# EasyEDA Pro project v02_N.eprj

# Schematic Schematic1
Board Name: Board1; Create Date: 2023-01-16; Project Name: v02_k; Schematic Name: Schematic1; Update Date: 2024-09-27; Company: KC3LBR; Version: 2023.09.11
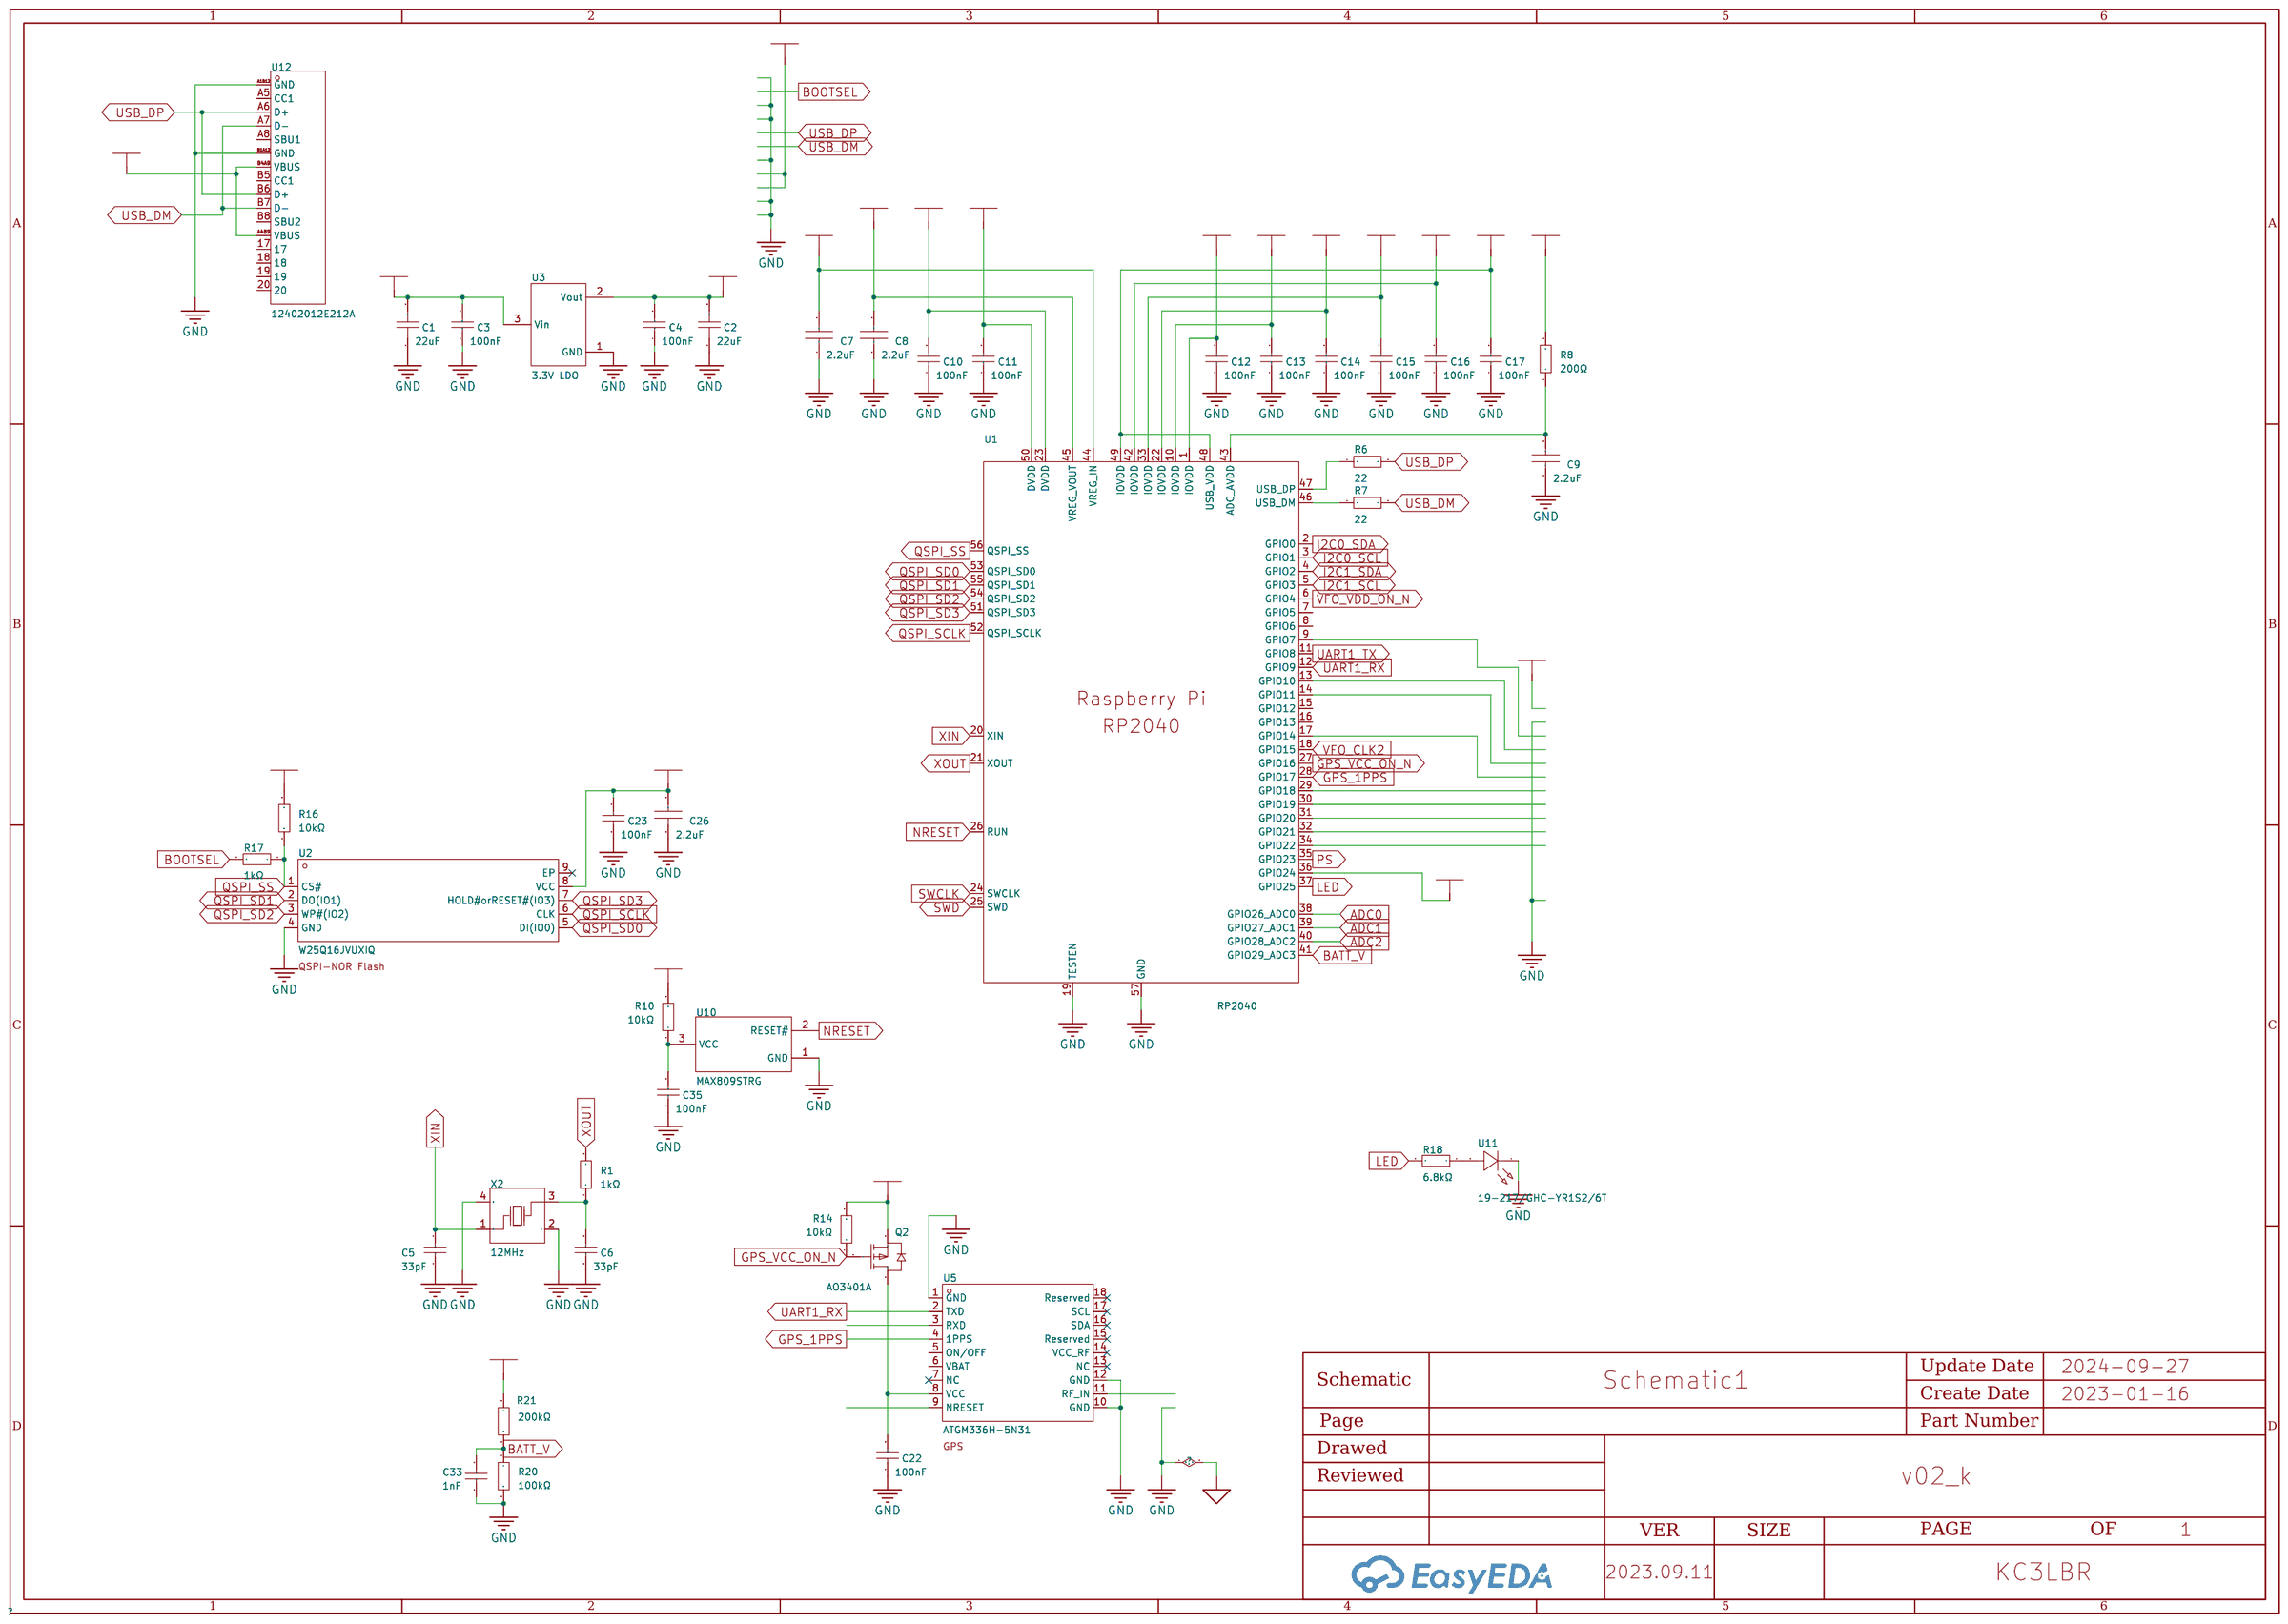
[diagram p0: schematic sheet]

## Parts
C1  22uF  [C0805]
C2  22uF  [C0603]
C3  100nF  [C0402_NEW]
C4  100nF  [C0402_NEW]
C5  33pF  [C0402]
C6  33pF  [C0402]
C7  2.2uF  [C0402]
C8  2.2uF  [C0402]
C9  2.2uF  [C0402]
C10  100nF  [C0402_NEW]
C11  100nF  [C0402_NEW]
C12  100nF  [C0402_NEW]
C13  100nF  [C0402_NEW]
C14  100nF  [C0402_NEW]
C15  100nF  [C0402_NEW]
C16  100nF  [C0402_NEW]
C17  100nF  [C0402_NEW]
C22  100nF  [C0402_NEW]
C23  100nF  [C0402_NEW]
C26  2.2uF  [C0402]
C33  1nF  [C0402]
C35  100nF  [C0402_NEW]
Q2  AO3401A  [SOT-23_L2.9-W1.3-P1.90-LS2.4-BR]
R1  1kΩ  [R0402]
R6  22  [R0402]
R7  22  [R0402]
R8  200Ω  [R0402]
R10  10kΩ  [R0402]
R14  10kΩ  [R0402]
R16  10kΩ  [R0402]
R17  1kΩ  [R0402]
R18  6.8kΩ  [R0402]
R20  100kΩ  [R0402]
R21  200kΩ  [R0402]
U1  RP2040  [LQFN-56_L7.0-W7.0-P0.4-EP]
U2  W25Q16JVUXIQ  [USON-8_L3.0-W2.0-P0.50-BL-EP]
U3  3.3V LDO  [SOT-23-3_L2.9-W1.6-P1.90-LS2.8-BR]
U5  ATGM336H-5N31  [GPSM-SMD_ATGM336H-TR]
U10  MAX809STRG  [SOT-23-3_L2.9-W1.6-P1.90-LS2.8-BR]
U11  19-217/GHC-YR1S2/6T  [LED0603-RD_GREEN]
U12  12402012E212A  [USB-SMD_TYPE-C16PIN-1]
X2  12MHz  [OSC-SMD_4P-L3.2-W2.5-BL]

## Library data of the parts
C1 = CL21A226MAQNNNE_C45783: Capacitance: Tolerance:±20% Tolerance:±20% Voltage Rated: Temperature Coefficient:; LCSC Part Name: 22uF ±20% 25V; Supplier Part: C45783; Manufacturer: SAMSUNG(三星); Manufacturer Part: CL21A226MAQNNNE; Supplier Footprint: 0805; JLCPCB Part Class: Basic Part; Datasheet: https://atta.szlcsc.com/upload/public/pdf/source/20160103/1457707727161.pdf; Supplier: LCSC; Tolerance: ±20%
C2 = CL10A226MQ8NRNC: Capacitance: Tolerance:±20% Tolerance:±20% Voltage Rated: Temperature Coefficient:; LCSC Part Name: 22uF ±20% 6.3V; Supplier Part: C59461; Manufacturer: SAMSUNG(三星); Supplier Footprint: 0603; JLCPCB Part Class: Basic Part; Datasheet: https://atta.szlcsc.com/upload/public/pdf/source/20160103/1457707740762.pdf; Supplier: LCSC; Tolerance: ±20%
C3 C4 C10-C17 C22 C23 C35 = CL05B104KO5NNNC: Capacitance: Tolerance:±10% Tolerance:±10% Voltage Rated: Temperature Coefficient:; LCSC Part Name: 100nF ±10% 16V; Supplier Part: C1525; Manufacturer: SAMSUNG(三星); Supplier Footprint: 0402; JLCPCB Part Class: Basic Part; Datasheet: https://atta.szlcsc.com/upload/public/pdf/source/20160103/1457707674891.pdf; Supplier: LCSC; Tolerance: ±10%
C5 C6 = 0402CG330J500NT: Capacitance: Tolerance:±5% Tolerance:±5% Voltage Rated: Temperature Coefficient:; LCSC Part Name: 33pF ±5% 50V; Supplier Part: C1562; Manufacturer: FH(风华); Supplier Footprint: 0402; JLCPCB Part Class: Basic Part; Datasheet: https://atta.szlcsc.com/upload/public/pdf/source/20170923/C1562_1506149272462988369.pdf; Supplier: LCSC; Tolerance: ±5%
C7-C9 C26 = CL05A225MQ5NSNC: Capacitance: Tolerance:±20% Tolerance:±20% Voltage Rated: Temperature Coefficient:; LCSC Part Name: 2.2uF ±20% 6.3V; Supplier Part: C12530; Manufacturer: SAMSUNG(三星); Supplier Footprint: 0402; JLCPCB Part Class: Basic Part; Datasheet: https://atta.szlcsc.com/upload/public/pdf/source/20160103/1457707666860.pdf; Supplier: LCSC; Tolerance: ±20%
C33 = 0402B102K500NT: Capacitance: Tolerance:±10% Tolerance:±10% Voltage Rated: Temperature Coefficient:; LCSC Part Name: 1nF ±10% 50V; Supplier Part: C1523; Manufacturer: FH(风华); Supplier Footprint: 0402; JLCPCB Part Class: Basic Part; Datasheet: https://atta.szlcsc.com/upload/public/pdf/source/20170923/C1523_1506149254821988331.pdf; Supplier: LCSC; Tolerance: ±10%
Q2 = AO3401A_C15127: Type: Drain Source Voltage (Vdss): Continuous Drain Current (Id): Power Dissipation (Pd): Drain Source On Resistance (RDS(on)@Vgs,Id):44mΩ@10V,4.3A Gate Threshold Voltage (Vgs(th)@Id):1.3V@250uA; LCSC Part Name: P沟道 30V 4A; Supplier Part: C15127; Manufacturer: AOS; Supplier Footprint: SOT-23; JLCPCB Part Class: Basic Part; Datasheet: https://atta.szlcsc.com/upload/public/pdf/source/20160507/1462613609053.pdf; Supplier: LCSC; Drain Source On Resistance (RDS(on)@Vgs,Id): 44mΩ@10V,4.3A; Gate Threshold Voltage (Vgs(th)@Id): 1.3V@250uA
R1 R17 = 0402WGF1001TCE: Type:Thick Film Resistors Resistance: Tolerance:±1% Tolerance:±1% Power(Watts): Temperature Coefficient:±100ppm/ Temperature Coefficient:±100ppm/ Overload Voltage (Max): Operating Temperature Range:-55~+155 Operating Temperature Range:-55~+155; LCSC Part Name: 1kΩ ±1% 62.5mW; Supplier Part: C11702; Manufacturer: UNI-ROYAL(厚声); Supplier Footprint: 0402; JLCPCB Part Class: Basic Part; Datasheet: https://atta.szlcsc.com/upload/public/pdf/source/20200306/C422600_1E6D84923E4A46A82E41ADD87F860B5C.pdf; Supplier: LCSC; Type: Thick Film Resistors; Tolerance: ±1%; Temperature Coefficient: ±100ppm/; Operating Temperature Range: -55~+155
R6 R7 = 0402WGF220JTCE: LCSC Part Name: 22Ω(22R0) ±1% 编带; Supplier Part: C25092; Manufacturer: UNI-ROYAL(厚声); Supplier Footprint: 0402; JLCPCB Part Class: Basic Part; Datasheet: https://atta.szlcsc.com/upload/public/pdf/source/20170920/C25092_1505901206069982723.pdf; Supplier: LCSC
R8 = 0402WGF2000TCE: Type:Thick Film Resistors Resistance: Tolerance:±1% Tolerance:±1% Power(Watts): Temperature Coefficient:±100ppm/ Temperature Coefficient:±100ppm/ Overload Voltage (Max): Operating Temperature Range:-55~+155 Operating Temperature Range:-55~+155; LCSC Part Name: 200Ω ±1% 62.5mW; Supplier Part: C25087; Manufacturer: UNI-ROYAL(厚声); Supplier Footprint: 0402; JLCPCB Part Class: Basic Part; Datasheet: https://atta.szlcsc.com/upload/public/pdf/source/20200306/C422600_1E6D84923E4A46A82E41ADD87F860B5C.pdf; Supplier: LCSC; Type: Thick Film Resistors; Tolerance: ±1%; Temperature Coefficient: ±100ppm/; Operating Temperature Range: -55~+155
R10 R14 R16 = 0402WGF1002TCE: Type:Thick Film Resistors Resistance: Tolerance:±1% Tolerance:±1% Power(Watts): Temperature Coefficient:±100ppm/ Temperature Coefficient:±100ppm/ Overload Voltage (Max): Operating Temperature Range:-55~+155 Operating Temperature Range:-55~+155; LCSC Part Name: 10kΩ ±1% 62.5mW; Supplier Part: C25744; Manufacturer: UNI-ROYAL(厚声); Supplier Footprint: 0402; JLCPCB Part Class: Basic Part; Datasheet: https://atta.szlcsc.com/upload/public/pdf/source/20200306/C422600_1E6D84923E4A46A82E41ADD87F860B5C.pdf; Supplier: LCSC; Type: Thick Film Resistors; Tolerance: ±1%; Temperature Coefficient: ±100ppm/; Operating Temperature Range: -55~+155
R18 = 0402WGF6801TCE: Type:Thick Film Resistors Resistance: Tolerance:±1% Tolerance:±1% Power(Watts): Temperature Coefficient:±100ppm/ Temperature Coefficient:±100ppm/ Overload Voltage (Max): Operating Temperature Range:-55~+155 Operating Temperature Range:-55~+155; LCSC Part Name: 6.8kΩ ±1% 62.5mW; Supplier Part: C25917; Manufacturer: UNI-ROYAL(厚声); Supplier Footprint: 0402; JLCPCB Part Class: Basic Part; Datasheet: https://atta.szlcsc.com/upload/public/pdf/source/20200306/C422600_1E6D84923E4A46A82E41ADD87F860B5C.pdf; Supplier: LCSC; Type: Thick Film Resistors; Tolerance: ±1%; Temperature Coefficient: ±100ppm/; Operating Temperature Range: -55~+155
R20 = 0402WGF1003TCE: Type:Thick Film Resistors Resistance: Tolerance:±1% Tolerance:±1% Power(Watts): Temperature Coefficient:±100ppm/ Temperature Coefficient:±100ppm/ Overload Voltage (Max): Operating Temperature Range:-55~+155 Operating Temperature Range:-55~+155; LCSC Part Name: 100kΩ ±1% 62.5mW; Supplier Part: C25741; Manufacturer: UNI-ROYAL(厚声); Supplier Footprint: 0402; JLCPCB Part Class: Basic Part; Datasheet: https://atta.szlcsc.com/upload/public/pdf/source/20200306/C422600_1E6D84923E4A46A82E41ADD87F860B5C.pdf; Supplier: LCSC; Type: Thick Film Resistors; Tolerance: ±1%; Temperature Coefficient: ±100ppm/; Operating Temperature Range: -55~+155
R21 = 0402WGF2003TCE: Resistance: Tolerance: Power(Watts): Temperature Coefficient: Temperature Coefficient: Overload Voltage (Max): Operating Temperature Range: Operating Temperature Range:; LCSC Part Name: 200KΩ ±1%; Supplier Part: C25764; Manufacturer: UNI-ROYAL(厚声); Supplier Footprint: 0402; JLCPCB Part Class: Basic Part; Datasheet: https://atta.szlcsc.com/upload/public/pdf/source/20170920/C25764_1505901532268983339.pdf; Supplier: LCSC
U1 = RP2040_C2040: CPU Core:ARM Cortex-M0 Maximum Frequency:133MHz Supply Voltage Range:- Supply Voltage Range:- Internal Oscillator:- External Clock Frequency Rang:- External Clock Frequency Rang:- Program FLASH Size:- RAM Size:264KB EEPROM/Data FLASH Size:- GPIO Ports Num; LCSC Part Name: ARM Cortex-M0 133MHz RAM：264KB; Supplier Part: C2040; Manufacturer: Raspberry Pi(树莓派); Supplier Footprint: LQFN-56(7x7); JLCPCB Part Class: Extended Part; Datasheet: https://atta.szlcsc.com/upload/public/pdf/source/20210621/C2040_96F425825606B7957D87DD32E2512CA9.pdf; Supplier: LCSC; CPU Core: ARM Cortex-M0; Maximum Frequency: 133MHz; RAM Size: 264KB; GPIO Ports Number: 30; ADC (Units/Channels/bits): 1@x4ch/12bit; U(S)ART Number: 2; I2C Number: 2; (Q)SPI Number: 2; USB (H/D/OTG): USB Host/Device; Peripherals / Functions / Protocol Stacks: DMA；PWM
U2 = W25Q16JVUXIQ: QSPI-NOR Flash; Supplier Part: C2843335; Manufacturer: WINBOND(华邦); Supplier Footprint: USON-8; JLCPCB Part Class: Extended Part; Datasheet: https://atta.szlcsc.com/upload/public/pdf/source/20210629/C2843335_FB4D78B5076715625DC0C83F790D3044.pdf; Supplier: LCSC
U3 = XC6206P332MR_C5446: Output Type: Output Polarity:Positive Number of Outputs:1 Maximum Input Voltage:6V Output Voltage:3.3V~3.3V Output Voltage:3.3V~3.3V Dropout Voltage:680mV@(100mA) Output Current:200mA Power Supply Rejection Ratio (PSRR):-; LCSC Part Name: 正 Vin=6V Vout=3.3V 200mA; Supplier Part: C5446; Manufacturer: TOREX(特瑞仕); Manufacturer Part: XC6206P332MR; Supplier Footprint: SOT-23; JLCPCB Part Class: Basic Part; Datasheet: https://atta.szlcsc.com/upload/public/pdf/source/20130801/1457706628791.pdf; Supplier: LCSC; Output Polarity: Positive; Number of Outputs: 1; Maximum Input Voltage: 6V; Output Voltage: 3.3V~3.3V; Dropout Voltage: 680mV@(100mA); Output Current: 200mA
U5 = ATGM336H-5N31: GPS; Supplier Part: C90770; Manufacturer: 杭州中科微; Supplier Footprint: 9.7x10.1mm; JLCPCB Part Class: Extended Part; Datasheet: https://atta.szlcsc.com/upload/public/pdf/source/20161226/1482720799860.pdf; Supplier: LCSC
U10 = MAX809STRG: Output Type:推挽 Reset Active Level:低电平有效 Number of Voltages Monitored:1 Threshold Voltage:2.93V Reset Timeout:140ms Operating Temperature:-40~+105@(TJ) Operating Temperature:-40~+105@(TJ) Type of the Power Management Chip:Simple reset/Power-on reset; LCSC Part Name: Voltage Supervisor, Very Low Supply Current, 3-Pin Microprocessor, Reset Monitor; Supplier Part: C9965; Manufacturer: onsemi(安森美); Supplier Footprint: SOT-23; JLCPCB Part Class: Extended Part; Datasheet: https://atta.szlcsc.com/upload/public/pdf/source/20170918/C9965_1505727085373976535.PDF; Supplier: LCSC; Output Type: 推挽; Reset Active Level: 低电平有效; Number of Voltages Monitored: 1; Threshold Voltage: 2.93V; Reset Timeout: 140ms; Operating Temperature: -40~+105@(TJ); Type of the Power Management Chip: Simple reset/Power-on reset
U11 = 19-217/GHC-YR1S2/6T: LCSC Part Name: 翠绿; Supplier Part: C2986059; Manufacturer: EVERLIGHT(亿光); Supplier Footprint: 0603; JLCPCB Part Class: Extended Part; Datasheet: https://atta.szlcsc.com/upload/public/pdf/source/20220705/5270194960AA522E2931401D212035CB.pdf; Supplier: LCSC
U12 = 12402012E212A: LCSC Part Name: Type-C 母; Supplier Part: C5150972; Manufacturer: Amphenol; Supplier Footprint: SMD; JLCPCB Part Class: Extended Part; Datasheet: https://atta.szlcsc.com/upload/public/pdf/source/20230904/1AC50813D61D39FDC7D46AE00E914630.pdf; Supplier: LCSC; Connector Type: Type-C; Standard: USB 2.0; Gender: Female; Number of Contacts: 24P; Number of Ports: 1
X2 = X322512MSB4SI: Crystal Type:SMD Crystal Resonator Frequency: Frequency Tolerance:±10ppm Frequency Tolerance:±10ppm Frequency Stability:±30ppm Frequency Stability:±30ppm Load Capacitance: Operating Temperature: Operating Temperature:; LCSC Part Name: 12MHz ±10ppm 20pF; Supplier Part: C9002; Manufacturer: YXC(扬兴晶振); Supplier Footprint: SMD3225-4P; JLCPCB Part Class: Basic Part; Datasheet: https://atta.szlcsc.com/upload/public/pdf/source/20210329/C112971_1F611BDC486E193C1706F6D8EB5AA189.pdf; Supplier: LCSC; Crystal Type: SMD Crystal Resonator; Frequency Tolerance: ±10ppm; Frequency Stability: ±30ppm

## Nets
1V1: C8.2 C10.2 C11.2 U1.23(DVDD) U1.45(VREG_VOUT) U1.50(DVDD)
3V3: C2.2 C4.2 C7.2 C12.2 C13.2 C14.2 C15.2 C16.2 C17.2 C23.2 C26.2 Q2.2(S) R8.2 R10.2 R14.2 R16.2 U1.1(IOVDD) U1.10(IOVDD) U1.22(IOVDD) U1.33(IOVDD) U1.36(GPIO24) U1.42(IOVDD) U1.44(VREG_IN) U1.48(USB_VDD) U1.49(IOVDD) U2.8(VCC) U3.2(Vout)
GND: C1.1 C2.1 C3.1 C4.1 C5.1 C6.1 C7.1 C8.1 C9.1 C10.1 C11.1 C12.1 C13.1 C14.1 C15.1 C16.1 C17.1 C22.1 C23.1 C26.1 C33.1 C35.1 R20.2 U1.19(TESTEN) U1.57(GND) U2.4(GND) U3.1(GND) U5.1(GND) U5.10(GND) U5.12(GND) U10.1(GND) U11.1(K) U12.A1B12(GND) U12.B1A12(GND) X2.2(GND) X2.4(GND)
VBUS: C1.2 C3.2 R21.2 U3.3(Vin) U12.A4B9(VBUS) U12.B4A9(VBUS)
ADC0: U1.38(GPIO26_ADC0)
ADC1: U1.39(GPIO27_ADC1)
ADC2: U1.40(GPIO28_ADC2)
ADC_AVDD: C9.2 R8.1 U1.43(ADC_AVDD)
BATT_V: C33.2 R20.1 R21.1 U1.41(GPIO29_ADC3)
BOOTSEL: R17.2
GPIO7: U1.9(GPIO7)
GPIO10: U1.13(GPIO10)
GPIO11: U1.14(GPIO11)
GPIO14: U1.17(GPIO14)
GPIO18: U1.29(GPIO18)
GPIO19: U1.30(GPIO19)
GPIO20: U1.31(GPIO20)
GPIO21: U1.32(GPIO21)
GPIO22: U1.34(GPIO22)
GPS_1PPS: U1.28(GPIO17) U5.4(1PPS)
GPS_3V3: C22.2 Q2.3(D) U5.8(VCC)
GPS_ANT: U5.11(RF_IN)
GPS_VCC_ON_N: Q2.1(G) R14.1 U1.27(GPIO16)
I2C0_SCL: U1.3(GPIO1)
I2C0_SDA: U1.2(GPIO0)
I2C1_SCL: U1.5(GPIO3)
I2C1_SDA: U1.4(GPIO2)
LED: R18.2 U1.37(GPIO25)
NRESET: U1.26(RUN) U10.2(RESET#)
PS: U1.35(GPIO23)
QSPI_SCLK: U1.52(QSPI_SCLK) U2.6(CLK)
QSPI_SD0: U1.53(QSPI_SD0) U2.5(DI(IO0))
QSPI_SD1: U1.55(QSPI_SD1) U2.2(DO(IO1))
QSPI_SD2: U1.54(QSPI_SD2) U2.3(WP#(IO2))
QSPI_SD3: U1.51(QSPI_SD3) U2.7(HOLD#orRESET#(IO3))
QSPI_SS: R16.1 R17.1 U1.56(QSPI_SS) U2.1(CS#)
SWCLK: U1.24(SWCLK)
SWD: U1.25(SWD)
UART1_RX: U1.12(GPIO9) U5.2(TXD)
UART1_TX: U1.11(GPIO8)
USB_DM: R7.2 U12.A7(D-) U12.B7(D-)
USB_DP: R6.2 U12.A6(D+) U12.B6(D+)
VFO_CLK2: U1.18(GPIO15)
VFO_VDD_ON_N: U1.6(GPIO4)
XIN: C5.2 U1.20(XIN) X2.1(OSC1)
XOUT: R1.2 U1.21(XOUT)
$1N22362: R6.1 U1.47(USB_DP)
$1N70752: C6.2 R1.1 X2.3(OSC2)
$1N115739: C35.2 R10.1 U10.3(VCC)
$1N146095: R18.1 U11.2(A)
Net-(R7-1): R7.1 U1.46(USB_DM)

Not connected (* = marked no-connect by the designer): U1 7(GPIO5) 8(GPIO6) 15(GPIO12) 16(GPIO13); U2 9(EP)*; U5 3(RXD) 5(ON/OFF) 6(VBAT) 7(NC)* 9(NRESET) 13(NC)* 14(VCC_RF)* 15(Reserved)* 16(SDA)* 17(SCL)* 18(Reserved)*; U12 17 18 19 20 A5(CC1) A8(SBU1) B5(CC1) B8(SBU2)

# Board PCB1
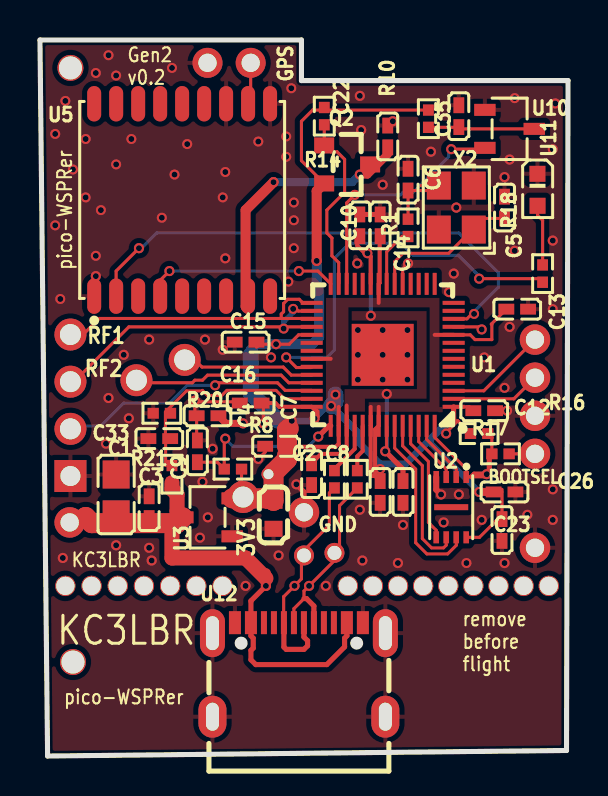
[diagram p1: board, top side]
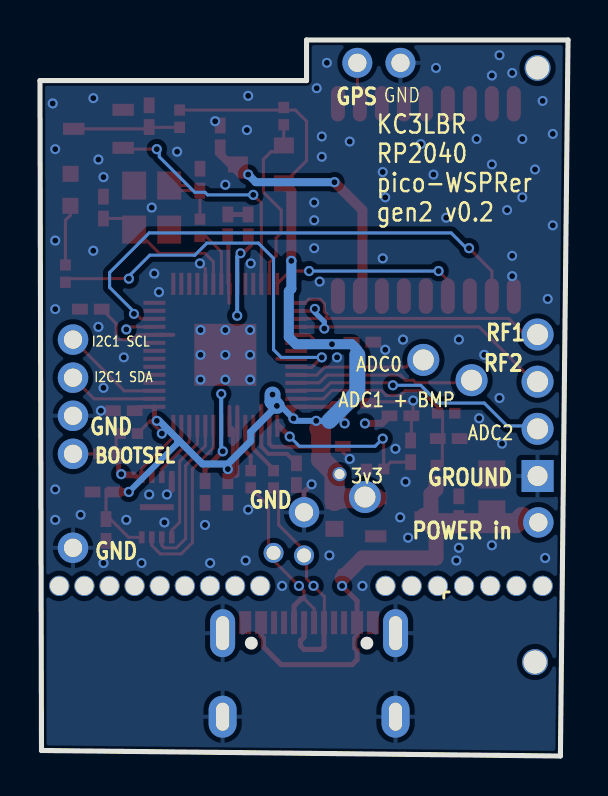
[diagram p2: board, bottom side, seen from below]

Outline 26.42 x 35.81 mm; copper layers: Top Layer, Bottom Layer. Coordinates in mm from the lower left corner of the outline.
Outline path: 0,35.81 0.38,0 26.34,0.28 26.42,33.78 13.08,33.78 13.08,35.81 0,35.81
Stack: Top Layer 0.035mm / Dielectric1 1.51mm FR4 er 4.5 / Bottom Layer 0.035mm

## Design rules (mm)
template: User Custom Config
spacing safeClearance (default): track to track 0.152, other pairs 0.12 to 0.3
track width trackWidth (default): min 0.127, default 0.254, max 2.54
differential pair differentialPair (default): width min 0.127, default 0.254, max 2.54; gap min 0.152, default 0.152
via viaSize (default): diameter min 0.5, default 0.61, max 10; hole min 0.3, default 0.305, max 5.999

## Placement (name value [footprint] x y rotation side)
C1  22uF  [C0805]  3.81 13.08 270 top
C2  22uF  [C0603]  11.68 12.06 90 top
C3  100nF  [C0402_NEW]  5.46 12.45 270 top
C4  100nF  [C0402_NEW]  8.38 17.02 0 top
C5  33pF  [C0402]  23.24 27.43 270 top
C6  33pF  [C0402]  18.41 28.83 270 top
C7  2.2uF  [C0402]  11.81 15.49 0 top
C8  2.2uF  [C0402]  13.59 14.1 90 top
C9  2.2uF  [C0402]  7.87 15.24 270 top
C10  100nF  [C0402_NEW]  16 26.54 270 top
C11  100nF  [C0402_NEW]  18.16 13.21 90 top
C12  100nF  [C0402_NEW]  22.22 17.27 180 top
C13  100nF  [C0402_NEW]  23.88 22.35 180 top
C14  100nF  [C0402_NEW]  17.02 26.54 270 top
C15  100nF  [C0402_NEW]  10.29 20.7 0 top
C16  100nF  [C0402_NEW]  10.54 17.65 0 top
C17  100nF  [C0402_NEW]  17.02 13.21 90 top
C22  100nF  [C0402_NEW]  17.4 30.99 270 top
C23  100nF  [C0402_NEW]  23.11 11.3 90 top
C26  2.2uF  [C0402]  23.24 13.21 180 top
C33  1nF  [C0402]  5.97 15.88 0 top
C35  100nF  [C0402_NEW]  20.95 32 270 top
GND  22  [R0402]  14.73 13.84 270 top
NOREF  -  [Pad_e5896]  1.52 34.42 0 top
NOREF#2  -  [Pad_e66]  14.73 10.16 0 top
NOREF#3  -  [Pad_e3799]  24.76 17.02 0 top
NOREF#4  -  [Pad_e41]  4.83 18.8 0 top
NOREF#5  -  [Pad_e1307]  1.27 8.51 0 top
NOREF#6  -  [Pad_e230]  24.76 10.42 0 top
NOREF#7  -  [Pad_e568]  10.54 34.67 0 top
NOREF#8  -  [Pad_e1295]  9.13 8.51 0 top
NOREF#9  -  [Pad_e1298]  19.17 8.51 0 top
NOREF#10  -  [Pad_e1293]  6.51 8.51 0 top
NOREF#11  -  [Pad_e2]  10.16 12.95 0 top
NOREF#12  -  [Pad_e54]  24.76 15.11 0 top
NOREF#13  -  [Pad_e1605]  13.21 12.19 0 top
NOREF#14  -  [Pad_e3084]  15.4 8.51 0 top
NOREF#15  -  [Pad_e369]  24.76 20.83 0 top
NOREF#16  -  [Pad_e854]  5.2 8.51 0 top
NOREF#17  -  [Pad_e1297]  17.91 8.51 0 top
NOREF#18  -  [Pad_e3364]  25.45 8.51 0 top
NOREF#19  -  [Pad_e33]  1.52 18.72 0 top
NOREF#20  -  [Pad_e2975]  13.21 10.03 0 top
NOREF#21  -  [Pad_e370]  24.76 18.92 0 top
NOREF#22  -  [Pad_e1299]  22.94 8.51 0 top
NOREF#23  -  [Pad_e1012]  8.38 34.67 0 top
NOREF#24  -  [Pad_e1300]  20.43 8.51 0 top
NOREF#25  -  [Pad_e5590]  1.65 4.7 0 top
NOREF#26  -  [Pad_e1301]  21.68 8.51 0 top
NOREF#27  -  [Pad_e4883]  24.2 8.51 0 top
NOREF#28  -  [Pad_e19]  1.52 14 0 top
NOREF#29  -  [Pad_e40]  7.24 19.81 0 top
NOREF#30  -  [Pad_e72]  1.49 11.68 0 top
NOREF#31  -  [Pad_e1294]  7.82 8.51 0 top
NOREF#32  -  [Pad_e1296]  16.66 8.51 0 top
NOREF#33  -  [Pad_e5893]  11.43 14.1 0 top
NOREF#34  -  [Pad_e35]  1.52 21.08 0 top
NOREF#35  -  [Pad_e1203]  2.58 8.51 0 top
NOREF#36  -  [Pad_e42]  1.52 16.36 0 top
NOREF#37  -  [Pad_e1306]  3.89 8.51 0 top
Q2  AO3401A  [SOT-23_L2.9-W1.3-P1.90-LS2.4-BR]  15.37 29.59 180 top
R1  1kΩ  [R0402]  18.41 26.42 270 top
R6  22  [R0402]  15.88 13.84 270 top
R8  200Ω  [R0402]  9.65 14.35 0 top
R10  10kΩ  [R0402]  19.43 31.88 90 top
R14  10kΩ  [R0402]  14.22 32 90 top
R16  10kΩ  [R0402]  21.97 16.13 180 top
R17  1kΩ  [R0402]  23.04 15.11 0 top
R18  6.8kΩ  [R0402]  25.15 24.13 270 top
R20  100kΩ  [R0402]  6.1 17.14 180 top
R21  200kΩ  [R0402]  6.6 14.1 270 top
U1  RP2040  [LQFN-56_L7.0-W7.0-P0.4-EP]  17.14 20.07 180 top
U2  W25Q16JVUXIQ  [USON-8_L3.0-W2.0-P0.50-BL-EP]  20.57 12.45 180 top
U3  3.3V LDO  [SOT-23-3_L2.9-W1.6-P1.90-LS2.8-BR]  8.38 11.94 0 top
U5  ATGM336H-5N31  [GPSM-SMD_ATGM336H-TR]  7.11 27.81 180 top
U10  MAX809STRG  [SOT-23-3_L2.9-W1.6-P1.90-LS2.8-BR]  23.49 31.37 180 top
U11  19-217/GHC-YR1S2/6T  [LED0603-RD_GREEN]  24.89 28.32 270 top
U12  12402012E212A  [USB-SMD_TYPE-C16PIN-1]  12.95 4.32 0 top
X2  12MHz  [OSC-SMD_4P-L3.2-W2.5-BL]  20.83 27.43 90 top

## Footprints (pads in the part's own frame, mm; a bottom-side part is the same pattern mirrored in y, then rotated)
C0402
  rect 0.79x0.54 smd: 1(-0.545,0) 2(0.545,0)
C0402_NEW
  rect 0.79x0.54 smd: 1(-0.545,0) 2(0.545,0)
C0603
  rect 0.8x0.9 smd: 1(-0.7,0) 2(0.7,0)
C0805
  rect 1.41x1.35 smd: 1(-1,0) 2(1,0)
GPSM-SMD_ATGM336H-TR
  oval 0.7x1.773 smd: 1(4.4,4.811) 2(3.3,4.811) 3(2.2,4.811) 4(1.1,4.811) 5(0,4.811) 6(-1.1,4.811) 7(-2.2,4.811) 8(-3.3,4.811) 9(-4.4,4.811) 10(-4.4,-4.811) 11(-3.3,-4.811) 12(-2.2,-4.811) 13(-1.1,-4.811) 14(0,-4.811) 15(1.1,-4.811) 16(2.2,-4.811) 17(3.3,-4.811) 18(4.4,-4.811)
LED0603-RD_GREEN
  rect 0.8x0.8 smd: 1(-0.799,-0.004) 2(0.799,0.004)
LQFN-56_L7.0-W7.0-P0.4-EP
  rect 1.1x0.2 smd: 1(-3.55,2.6) 2(-3.55,2.2) 3(-3.55,1.8) 4(-3.55,1.4) 5(-3.55,1) 6(-3.55,0.6) 7(-3.55,0.2) 8(-3.55,-0.2) 9(-3.55,-0.6) 10(-3.55,-1) 11(-3.55,-1.4) 12(-3.55,-1.8) 13(-3.55,-2.2) 14(-3.55,-2.6) 29(3.55,-2.6) 30(3.55,-2.2) 31(3.55,-1.8) 32(3.55,-1.4) 33(3.55,-1) 34(3.55,-0.6) 35(3.55,-0.2) 36(3.55,0.2) 37(3.55,0.6) 38(3.55,1) 39(3.55,1.4) 40(3.55,1.8) 41(3.55,2.2) 42(3.55,2.6)
  rect 0.2x1.1 smd: 15(-2.6,-3.55) 16(-2.2,-3.55) 17(-1.8,-3.55) 18(-1.4,-3.55) 19(-1,-3.55) 20(-0.6,-3.55) 21(-0.2,-3.55) 22(0.2,-3.55) 23(0.6,-3.55) 24(1,-3.55) 25(1.4,-3.55) 26(1.8,-3.55) 27(2.2,-3.55) 28(2.6,-3.55) 43(2.6,3.55) 44(2.2,3.55) 45(1.8,3.55) 46(1.4,3.55) 47(1,3.55) 48(0.6,3.55) 49(0.2,3.55) 50(-0.2,3.55) 51(-0.6,3.55) 52(-1,3.55) 53(-1.4,3.55) 54(-1.8,3.55) 55(-2.2,3.55) 56(-2.6,3.55)
  rect 3.1x3.1 smd: 57(0,0)
OSC-SMD_4P-L3.2-W2.5-BL
  rect 1.4x1.2 smd: 1(-1.1,-0.875) 2(1.1,-0.875) 3(1.1,0.875) 4(-1.1,0.875)
Pad_e2
  round 1.6 hole 1.05: 15(0,0)
Pad_e19
  rect 1.6x1.6 hole 1: 7(0,0)
Pad_e33
  round 1.6 hole 1.05: 14(0,0)
Pad_e35
  round 1.6 hole 1.05: 15(0,0)
Pad_e40
  round 1.6 hole 1.05: 15(0,0)
Pad_e41
  round 1.6 hole 1.05: 17(0,0)
Pad_e42
  round 1.6 hole 1.05: 18(0,0)
Pad_e54
  round 1.524 hole 0.914: 17(0,0)
Pad_e66
  round 1 hole 0.7: 75(0,0)
Pad_e72
  round 1.524 hole 0.914: 98(0,0)
Pad_e230
  round 1.524 hole 0.914: 118(0,0)
Pad_e369
  round 1.524 hole 0.914: 108(0,0)
Pad_e370
  round 1.524 hole 0.914: 111(0,0)
Pad_e568
  round 1.5 hole 0.914: 4(0,0)
Pad_e854
  round 1.016 hole 0.914: 0(0,0)
Pad_e1012
  round 1.5 hole 0.914: 9(0,0)
Pad_e1203
  round 1.016 hole 0.914: 15(0,0)
Pad_e1293
  round 1.016 hole 0.914: 1(0,0)
Pad_e1294
  round 1.016 hole 0.914: 2(0,0)
Pad_e1295
  round 1.016 hole 0.914: 3(0,0)
Pad_e1296
  round 1.016 hole 0.914: 4(0,0)
Pad_e1297
  round 1.016 hole 0.914: 5(0,0)
Pad_e1298
  round 1.016 hole 0.914: 6(0,0)
Pad_e1299
  round 1.016 hole 0.914: 7(0,0)
Pad_e1300
  round 1.016 hole 0.914: 14(0,0)
Pad_e1301
  round 1.016 hole 0.914: 23(0,0)
Pad_e1306
  round 1.016 hole 0.914: 14(0,0)
Pad_e1307
  round 1.016 hole 0.914: 15(0,0)
Pad_e1605
  round 1.524 hole 0.914: 118(0,0)
Pad_e2975
  round 1 hole 0.7: 79(0,0)
Pad_e3084
  round 1.016 hole 0.914: 29(0,0)
Pad_e3364
  round 1.016 hole 0.914: 11(0,0)
Pad_e3799
  round 1.524 hole 0.914: 106(0,0)
Pad_e4883
  round 1.016 hole 0.914: 40(0,0)
Pad_e5590
  round 1.3 hole 1.152: 3(0,0)
Pad_e5893
  round 0.7 hole 0.5: 116(0,0)
Pad_e5896
  round 1.3 hole 1.152: 1(0,0)
R0402
  rect 0.566x0.54 smd: 1(-0.433,0) 2(0.433,0)
SOT-23-3_L2.9-W1.6-P1.90-LS2.8-BR
  rect 1.07x0.6 smd: 1(1.235,-0.95) 2(1.235,0.95) 3(-1.235,0)
SOT-23_L2.9-W1.3-P1.90-LS2.4-BR
  rect 1x0.8 smd: 1(1.15,-0.95) 2(1.15,0.95) 3(-1.15,0)
USB-SMD_TYPE-C16PIN-1
  oval 1.25x2.4 hole 0.65x1.7: 17(-4.325,1.827) 18(4.325,1.827)
  oval 1.4x2.1 hole 0.65x1.4: 19(-4.325,-2.353) 20(4.325,-2.353)
  rect 0.6x1.15 smd: A1B12(-3.2,2.353) A4B9(-2.4,2.353) B1A12(3.2,2.353) B4A9(2.4,2.353)
  rect 0.3x1.15 smd: A5(-1.25,2.353) A6(-0.25,2.353) A7(0.25,2.353) A8(1.25,2.353) B5(1.75,2.353) B6(0.75,2.353) B7(-0.75,2.353) B8(-1.75,2.353)
USON-8_L3.0-W2.0-P0.50-BL-EP
  rect 0.28x0.6 smd: 1(-0.75,-1.508) 2(-0.25,-1.508) 3(0.25,-1.508) 4(0.75,-1.508) 5(0.75,1.508) 6(0.25,1.508) 7(-0.25,1.508) 8(-0.75,1.508)
  rect 1.7x0.3 smd: 9(0,0)

## Nets
1V1: C8.2 C10.2 C11.2 U1.23 U1.45 U1.50
3V3: C2.2 C4.2 C7.2 C12.2 C13.2 C14.2 C15.2 C16.2 C17.2 C23.2 C26.2 NOREF#11.15 NOREF#33.116 Q2.2 R8.2 R10.2 R14.2 R16.2 U1.1 U1.10 U1.22 U1.33 U1.36 U1.42 U1.44 U1.48 U1.49 U2.8 U3.2
GND: C1.1 C2.1 C3.1 C4.1 C5.1 C6.1 C7.1 C8.1 C9.1 C10.1 C11.1 C12.1 C13.1 C14.1 C15.1 C16.1 C17.1 C22.1 C23.1 C26.1 C33.1 C35.1 NOREF#3.106 NOREF#6.118 NOREF#13.118 NOREF#23.9 NOREF#28.7 R20.2 U1.19 U1.57 U2.4 U3.1 U5.1 U5.10 U5.12 U10.1 U11.1 U12.17 U12.18 U12.19 U12.20 U12.A1B12 U12.B1A12 X2.2 X2.4
VBUS: C1.2 C3.2 NOREF#30.98 R21.2 U3.3 U12.A4B9 U12.B4A9
ADC0: NOREF#29.15 U1.38
ADC1: NOREF#4.17 U1.39
ADC2: NOREF#36.18 U1.40
ADC_AVDD: C9.2 R8.1 U1.43
BATT_V: C33.2 R20.1 R21.1 U1.41
BOOTSEL: NOREF#12.17 R17.2
GPIO7: U1.9
GPIO10: U1.13
GPIO11: U1.14
GPIO14: U1.17
GPIO19: NOREF#34.15 U1.29 U1.31
GPIO20: NOREF#19.14 U1.30 U1.32
GPIO22: U1.34
GPS_1PPS: U1.28 U5.4
GPS_3V3: C22.2 Q2.3 U5.8
GPS_ANT: NOREF#7.4 U5.11
GPS_VCC_ON_N: Q2.1 R14.1 U1.27
I2C0_SCL: NOREF#15.108 U1.3
I2C0_SDA: NOREF#21.111 U1.2
I2C1_SCL: U1.5
I2C1_SDA: U1.4
LED: R18.2 U1.37
NRESET: U1.26 U10.2
PS: U1.35
QSPI_SCLK: U1.52 U2.6
QSPI_SD0: U1.53 U2.5
QSPI_SD1: U1.55 U2.2
QSPI_SD2: U1.54 U2.3
QSPI_SD3: U1.51 U2.7
QSPI_SS: R16.1 R17.1 U1.56 U2.1
SWCLK: U1.24
SWD: U1.25
UART1_RX: U1.12 U5.2
UART1_TX: U1.11
USB_DM: GND.2 NOREF#20.79 U12.A7 U12.B7
USB_DP: NOREF#2.75 R6.2 U12.A6 U12.B6
VFO_CLK2: U1.18
VFO_VDD_ON_N: U1.6
XIN: C5.2 U1.20 X2.1
XOUT: R1.2 U1.21
$1N14036: U5.3
$1N14334: U5.9
$1N22007: GND.1 U1.46
$1N22362: R6.1 U1.47
$1N70752: C6.2 R1.1 X2.3
$1N115739: C35.2 R10.1 U10.3
$1N146095: R18.1 U11.2

Pads without a net: NOREF 1; NOREF#5 15; NOREF#8 3; NOREF#9 6; NOREF#10 1; NOREF#14 29; NOREF#16 0; NOREF#17 5; NOREF#18 11; NOREF#22 7; NOREF#24 14; NOREF#25 3; NOREF#26 23; NOREF#27 40; NOREF#31 2; NOREF#32 4; NOREF#35 15; NOREF#37 14; U1 7 8 15 16; U2 9; U5 5 6 7 13 14 15 16 17 18; U12 A5 A8 B5 B8

## Via types
v1: diameter 0.508, hole 0.3, Top Layer to Bottom Layer, 91 vias
v2: diameter 0.5, hole 0.3, Top Layer to Bottom Layer, 41 vias
v3: diameter 0.5, hole 0.305, Top Layer to Bottom Layer, 1 via

## Routing (per net, layer and track width the routed paths; a pad name or vN(x,y) marks a point on that pad's centre or on a via; arc(x,y) is an arc through that point)
1V1: length 16.2
  Top Layer w0.154: 17.34,15.17 U1.50
  Top Layer w0.2: 15.88,25.99 15.88,25.53 16.26,25.15 v2(16.38,25.15) 16.54,24.98 U1.23 ; C8.2 14.06,15.11 14.99,15.11 15.34,15.47 U1.45 15.34,17.53
  Top Layer w0.254: v1(17.27,15.24) 18.16,14.35 C11.2
  Bottom Layer w0.2: v2(16.38,25.15) 16.55,24.98 v1(16.55,22.02) ; v1(17.27,15.24) 17.35,15.32 v1(17.35,18.11)
3V3: length 87.2
  Top Layer w0.154: R8.2 10.08,13.8 9.62,13.33 U3.2 ; 20.69,17.47 21.49,17.47 C12.2 ; 12.36,15.02 12.36,15.49 ; U1.33 12.94,21.07 12.47,20.6 v1(11.81,20.6) 10.98,20.6 10.83,20.45 ; Q2.2 13.08,29.78 13.08,31.75 13.64,32.31 R10.2 ; 20.9,16.76 20.32,16.18 v1(20.32,16.13) ; 20.9,16.76 v1(20.57,16.76) ; 20.9,16.76 21.54,16.13 ; C16.2 11.18,17.56 v1(11.18,16.64) ; 23.11,13.33 C23.2 22.9,11.85 21.99,10.94 U2.8 ; U1.10 21.53,21.07 21.76,20.83 22.61,20.83 22.61,21.58 22.58,21.6 C13.2
  Top Layer w0.2: 16.76,14.01 16.76,16.33 U1.49 16.94,17.46 ; 16.76,14.01 16.6,14.01 16.54,14.06 U1.48 16.54,17.46 ; 16.76,14.01 C17.2 ; 14.94,17.46 U1.44 14.94,15.62 14.79,15.47 12.76,15.47 ; 13.83,17.23 13.59,17.47 11.97,17.47 11.78,17.65 C16.2 ; U1.36 14.54,19.87 ; 16.94,22.67 U1.22 16.99,23.66 16.99,25.97 C14.2 17.02,26.12 ; U1.10 19.75,21.07 ; 14.57,17.47 14.52,17.47
  Top Layer w0.25: 20.69,17.47 20.69,16.89 v1(20.57,16.76)
  Top Layer w0.3: v1(13.74,16.88) 13.83,16.98 13.83,17.23
  Top Layer w0.35: v1(10.16,16.64) 9.31,16.64 C4.2
  Top Layer w0.4: v1(21.97,13.21) 22.99,13.21
  Top Layer w0.5: Q2.2 13.84,28.27 v1(13.84,24.77)
  Top Layer w1: 12.45,16.38 12.36,16.29 12.36,15.49 ; 12.36,15.02 12.36,14.83 11.68,14.16 C2.2 11.56,12.89 U3.2
  Bottom Layer w0.3: 11.94,16.76 v1(12.6,16.76) 13.62,16.76 v1(13.74,16.88) 14.37,17.51 v1(14.57,17.51) ; 19.56,15.88 19.56,15.62 v1(21.97,13.21)
  Bottom Layer w0.35: v1(20.57,16.76) 20.45,16.76 18.29,14.61 17.01,14.61 15.88,15.75 15.88,16.2 v1(14.57,17.51)
  Bottom Layer w0.5: v1(13.84,24.77) 13.84,23.36 13.97,23.24 13.97,20.95 13.61,20.6 v1(11.81,20.6) 10.82,20.6 10.54,20.32
  Bottom Layer w0.8: 11.94,16.76 10.54,18.16 10.54,20.06 ; v1(14.78,18.08) 14.78,17.73 v1(14.57,17.51)
  vias: v1(17.02,14.35)
GND: length 10.1
  Top Layer w0.15: U1.19 18.14,24.37 v1(18.41,24.64)
  Top Layer w0.154: C16.1 9.93,17.72 7.81,17.72 v1(7.75,17.78) 7.75,17.11 C4.1 7.84,15.62 ; v1(10.92,14.86) 11.27,15.2 C7.1
  Top Layer w0.254: NOREF#13.118 13.21,13.21 v1(12.83,13.59) ; 15.88,27.09 C14.1
  Top Layer w0.3: U2.4 19.82,13.32 v1(20.07,13.08)
  vias: v1(1.14,9.91) v1(2.79,24) v1(3.43,17.91) v1(3.81,10.54) v1(4.19,20.07) v1(4.44,16.89) v1(5.46,20.83) v1(5.46,10.41) v1(5.59,9.78) v1(8,10.92) v1(8.13,13.72) v1(8.25,20.83) v1(8.4,11.94) v1(8.64,15.37) v1(9.14,20.32) v1(9.27,24.89) v1(10.29,8.51) v1(11.56,19.94) v1(11.94,10.03) v1(14.3,8.51) v1(15.88,24.64) v1(15.91,21.31) v1(15.91,20.07) v1(15.91,18.83) v1(16,33.02) v1(16.07,31.31) v1(16,12.32) v1(16.13,9.78) v1(17.14,28.58) v1(17.14,21.31) v1(17.14,20.07) v1(17.14,18.83) v1(17.65,31.75) v1(17.91,9.65) v1(18.16,11.56) v1(18.38,21.31) v1(18.38,20.07) v1(18.38,18.83) v1(19.56,30.23) v1(20.19,11.68) v1(20.46,23.2) v1(20.7,24.13) v1(20.83,27.43) v1(20.95,13.08) v1(22.1,11.81) v1(23.24,28.96) v1(23.24,9.65) v1(23.37,17.27) v1(23.49,29.83) v1(23.49,21.46) v1(23.75,25.27) v1(25.65,25.78) v1(25.65,11.81) v1(25.78,32.64) v2(0.76,31.11) v2(0.76,26.54) v2(1.02,22.86) v2(1.27,32.77) v2(1.65,29.34) v2(2.29,30.86) v2(2.29,27.94) v2(2.79,34.16) v2(2.79,25.02) v2(3.05,27.31) v2(3.3,15.62) v2(3.43,35.05) v2(3.81,34.04) v2(3.81,29.59) v2(4.57,30.86) v2(6.1,26.92) v2(6.6,34.42) v2(6.73,29.08) v2(7.37,30.61) v2(9.14,27.94) v2(9.27,29.21) v2(10.92,30.73) v2(12.06,34.67) v2(12.32,30.99) v2(12.32,29.97) v2(12.43,23.73) v2(12.57,33.4) v2(12.7,27.69) v2(12.7,26.8) v2(12.7,25.4) v2(21.34,9.65) v2(22.22,19.94) v2(23.24,18.42) v2(23.75,32.91) v2(24.38,12.06) v2(25.65,30.35) v2(25.65,22.35) v2(25.65,13.33)
VBUS: length 25.1
  Top Layer w0.254: v1(11.3,8.51) 10.55,7.76 U12.A4B9 10.55,6.01 10.67,5.9 10.67,5.4 10.55,5.28 10.55,4.81 10.79,4.57 14.35,4.57 15.24,5.46 15.24,5.9 15.35,6.01 U12.B4A9
  Top Layer w0.5: 11.3,9.14 v1(11.3,8.51)
  Top Layer w0.75: 11.3,8.89 10.29,9.91 6.6,9.91 6.6,11.65 ; U3.3 6.86,12.23 6.86,13.09 6.6,13.35 6.6,13.66
  Top Layer w1: U3.3 6.86,11.65 2.59,11.65 2.29,11.95 2.27,11.94
ADC0: length 6.8
  Top Layer w0.154: 7.11,19.81 7.75,19.81 8.1,19.46 12.17,19.46 12.57,19.05 13.58,19.05 U1.38
ADC1: length 9.4
  Top Layer w0.154: 4.7,19.18 5.21,18.67 7.62,18.67 7.75,18.8 8.13,18.8 8.38,19.05 12.06,19.05 12.45,18.67 13.59,18.67 U1.39
ADC2: length 13.1
  Top Layer w0.154: U1.40 13.57,18.29 12.26,18.29 11.88,18.67 8.89,18.67 v1(8.76,18.54)
  Bottom Layer w0.154: 1.52,16.51 3.05,16.51 4.19,17.65 6.48,17.65 7.37,18.54 v1(8.76,18.54)
ADC_AVDD: length 8.9
  Top Layer w0.154: v1(9.27,15.88) 9.22,15.82 R8.1 8.88,14.69 C9.2
  Top Layer w0.254: v1(13.92,15.98) 14.46,16.52 U1.43
  Bottom Layer w0.154: v1(13.92,15.98) 13.44,15.49 9.65,15.49 v1(9.27,15.88)
BATT_V: length 10.8
  Top Layer w0.15: 6.29,14.53 6.29,15.85 6.26,15.88 6.27,15.89 6.27,17.21 7.33,18.26 8.1,18.26 8.13,18.29 8.38,18.03 9.09,18.03 9.35,18.29 11.81,18.29 12.23,17.87 U1.41
BOOTSEL: length 1.9
  Top Layer w0.154: 23.47,15.11 24.64,15.11 25.15,14.61
GPIO19: length 15
  Top Layer w0.154: 1.52,20.45 2.96,21.89 12.07,21.89 ; 12.07,21.89 12.07,22.1 12.19,22.22 12.19,22.63 12.4,22.84 12.97,22.84 13.15,22.67 U1.29 ; 12.07,21.89 13.58,21.89 U1.31
GPIO20: length 15.3
  Top Layer w0.154: v3(12.67,22.36) 12.81,22.36 12.92,22.25 13.58,22.25 U1.30 ; 1.52,18.92 1.91,18.92 4.45,21.47 13.59,21.47
  Bottom Layer w0.254: v2(12.19,21.38) 12.19,21.72 12.67,22.19 v3(12.67,22.36)
GPS_1PPS: length 10.4
  Top Layer w0.154: 6.01,22.37 6.01,23.79 v1(6.48,24.26) ; U1.28 13.9,24.26 v1(12.95,24.26)
  Bottom Layer w0.154: v1(12.95,24.26) v1(6.48,24.26)
GPS_3V3: length 13.6
  Top Layer w0.4: v1(16,29.08) 16.38,29.08 17.4,30.1 C22.2
  Top Layer w0.5: v1(11.68,28.7) 10.29,27.31 10.29,22.49 10.41,22.37
  Bottom Layer w0.4: v1(16,29.08) 15.62,28.7 v1(11.68,28.7)
GPS_ANT: length 2.4
  Top Layer w0.154: 10.41,31.99 10.54,32.12 10.54,34.29
GPS_VCC_ON_N: length 9.2
  Top Layer w0.154: U1.27 14.94,24.68 14.6,25.02 14.6,25.91 14.35,26.16 14.35,27.31 15.24,28.19 15.24,29.84 14.86,30.23 14.53,30.23 Q2.1 14.22,30.55 R14.1
I2C0_SCL: length 5.1
  Top Layer w0.154: U1.3 22.2,18.27 NOREF#15.108
I2C0_SDA: length 4.4
  Top Layer w0.154: 20.75,17.87 23.71,17.87 NOREF#21.111
LED: length 20.6
  Top Layer w0.154: v1(12.32,19.94) 12.83,19.43 13.56,19.43 13.59,19.47 ; v1(21.97,23.88) 25.12,23.88 25.3,23.7 R18.2
  Bottom Layer w0.154: v1(21.97,23.88) 21.97,24 20.92,25.05 18.67,25.05 18.06,25.65 15.49,25.65 14.73,24.89 14.73,20.32 14.35,19.94 v1(12.32,19.94)
NRESET: length 12.5
  Top Layer w0.154: U1.26 15.34,27.66 v1(15.75,28.07) ; v1(20.57,30.35) 22.45,30.35 22.51,30.42
  Bottom Layer w0.154: v1(20.57,30.35) 20.45,30.23 20.45,29.97 18.67,28.19 18.16,28.19 18.03,28.07 v1(15.75,28.07)
QSPI_SCLK: length 7.9
  Top Layer w0.15: U1.52 18.14,15.51 19.13,14.53 19.13,10.87 19.59,10.41 20.19,10.41 20.32,10.55 U2.6
QSPI_SD0: length 6.1
  Top Layer w0.15: U2.5 19.82,11.29 19.43,11.68 19.43,14.73 18.54,15.62 U1.53
QSPI_SD1: length 3.2
  Top Layer w0.15: U1.55 19.34,15.83 20.83,14.35 20.83,13.96 U2.2
QSPI_SD2: length 3.1
  Top Layer w0.15: U2.3 20.32,13.96 20.32,14.35 18.94,15.73 U1.54
QSPI_SD3: length 9.1
  Top Layer w0.15: U1.51 17.74,15.4 18.8,14.35 18.8,10.67 19.36,10.11 20.4,10.11 20.83,10.54 20.83,10.93 U2.7
QSPI_SS: length 7.3
  Top Layer w0.15: U2.1 21.34,13.97 21.34,14.35 19.74,15.94 U1.56
  Top Layer w0.154: R16.1 22.61,15.93 R17.1 ; v1(22.35,14.1) 22.22,13.97 21.34,13.97
  Top Layer w0.254: R17.1 22.48,14.99 22.48,14.22 v1(22.35,14.1) 21.73,14.1 21.59,13.97
UART1_RX: length 26.4
  Top Layer w0.15: 21.72,22.22 21.36,21.87 U1.12
  Top Layer w0.154: 3.81,22.37 3.81,22.37 3.81,24.26 v1(4.95,25.4)
  Bottom Layer w0.154: v1(4.95,25.4) 5.08,25.4 5.84,26.16 20.95,26.16 22.93,24.18 22.93,23.44 21.59,22.1
  vias: v2(21.72,22.11)
UART1_TX: length 1.5
  Top Layer w0.154: v1(22.1,21.34) 21.97,21.47 20.69,21.47
USB_DM: length 11.6
  Top Layer w0.154: U12.B7 12.19,6.68 12.19,7.97 v1(12.73,8.51) 13.08,8.86 13.08,10.16 14.48,11.56 14.48,13.16 GND.2
  Top Layer w0.254: U12.B7 12.2,5.45 12.32,5.33 13.21,5.33 13.39,5.51 13.39,5.77 13.2,5.95 U12.A7
USB_DP: length 9.5
  Top Layer w0.154: R6.2 14.99,12.52 14.99,10.03 v1(13.46,8.51) 13.21,8.25 13.21,7.87 12.7,7.37 U12.A6
  Top Layer w0.254: U12.B6 13.7,7.5 13.33,7.87 13.21,7.87
XIN: length 7.5
  Top Layer w0.15: U1.20 17.74,24.73 18.16,25.15 20.45,25.15 22.19,26.89 C5.2
XOUT: length 3
  Top Layer w0.15: R1.2 18.11,25.98 17.34,25.22 U1.21
$1N22007: length 2.7
  Top Layer w0.2: U1.46 15.74,15.36 14.73,14.35 GND.1
$1N22362: length 2.4
  Top Layer w0.2: R6.1 15.88,14.99 16.14,15.26 U1.47
$1N70752: length 4
  Top Layer w0.154: 19.06,28.53 X2.3 19.7,28.28 18.41,28.28 R1.1
$1N115739: length 5.3
  Top Layer w0.154: 19.43,31.44 20.94,31.44 C35.2 21.04,31.37 U10.3
$1N146095: length 2.9
  Top Layer w0.154: 24.89,27.38 24.89,27.05 25.15,26.8 R18.1

## Copper pours and planes (outline as drawn; the poured copper is in the pictures)
1V1 on Top Layer: 15.24,22.25 19.34,22.25 19.34,17.22 15.24,17.22
3V3 on Top Layer: 14.31,22.91 19.98,22.91 19.98,17.22 14.31,17.22
3V3 on Top Layer: 10.29,17.2 13.96,17.2 13.96,16.57 10.29,16.57
GND on Top Layer: -3.3,49.4 28.6,49.4 28.6,-6.26 -3.3,-6.26
GND on Bottom Layer: -3.43,39.5 27.94,39.5 27.94,-4.7 -3.43,-4.7

Small or netless copper shapes (teardrops, artwork), in the pictures only: 2 on Top Layer

## Text on the board
Bottom Silkscreen Layer: I2C1 SDA | I2C1 SCL | GND | ADC2 | ADC0 | 3v3 | ADC1 + BMP | BOOTSEL | POWER in | RF1 | - | RF2 | + | GROUND | GPS | KC3LBR / RP2040 / pico-WSPRer / gen2 v0.2
Top Silkscreen Layer: BOOTSEL | pico-WSPRer | KC3LBR | Gen2 / v0.2 | remove / before / flight | GPS | RF2 | RF1 | 3V3
